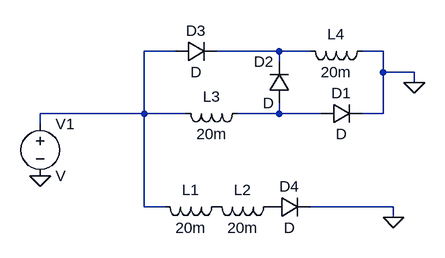
[diagram p0: schematic bosstedInductor.asc]
bosstedInductor.asc, the LTspice schematic file:
Version 4
SHEET 1 880 680
WIRE 176 -176 128 -176
WIRE 336 -176 240 -176
WIRE 384 -176 336 -176
WIRE 496 -176 464 -176
WIRE 336 -160 336 -176
WIRE 496 -144 496 -176
WIRE 544 -144 496 -144
WIRE 544 -128 544 -144
WIRE 128 -80 128 -176
WIRE 128 -80 -32 -80
WIRE 192 -80 128 -80
WIRE 336 -80 336 -96
WIRE 336 -80 272 -80
WIRE 400 -80 336 -80
WIRE 496 -80 496 -144
WIRE 496 -80 464 -80
WIRE -32 -64 -32 -80
WIRE 128 64 128 -80
WIRE 160 64 128 64
WIRE 512 64 384 64
WIRE 512 80 512 64
FLAG -32 16 0
FLAG 512 80 0
FLAG 544 -128 0
SYMBOL ind 256 48 R90
WINDOW 0 5 56 VBottom 2
WINDOW 3 32 56 VTop 2
SYMATTR InstName L1
SYMATTR Value 20m
SYMBOL ind 336 48 R90
WINDOW 0 5 56 VBottom 2
WINDOW 3 32 56 VTop 2
SYMATTR InstName L2
SYMATTR Value 20m
SYMBOL ind 288 -96 R90
WINDOW 0 5 56 VBottom 2
WINDOW 3 32 56 VTop 2
SYMATTR InstName L3
SYMATTR Value 20m
SYMBOL ind 480 -192 R90
WINDOW 0 5 56 VBottom 2
WINDOW 3 32 56 VTop 2
SYMATTR InstName L4
SYMATTR Value 20m
SYMBOL diode 400 -64 R270
WINDOW 0 32 32 VTop 2
WINDOW 3 0 32 VBottom 2
SYMATTR InstName D1
SYMBOL diode 352 -96 R180
WINDOW 0 24 64 Left 2
WINDOW 3 24 0 Left 2
SYMATTR InstName D2
SYMBOL diode 176 -160 R270
WINDOW 0 32 32 VTop 2
WINDOW 3 0 32 VBottom 2
SYMATTR InstName D3
SYMBOL diode 320 80 R270
WINDOW 0 32 32 VTop 2
WINDOW 3 0 32 VBottom 2
SYMATTR InstName D4
SYMBOL voltage -32 -80 R0
SYMATTR InstName V1

The netlist it stands for:
* bosstedInductor.asc
L1 P001 N001 20m
L2 P002 P001 20m
L3 N003 N001 20m
L4 0 N002 20m
D1 N003 0 D
D2 N003 N002 D
D3 N001 N002 D
D4 P002 0 D
V1 N001 0 V
.model D D
.lib standard.dio
.backanno
.end